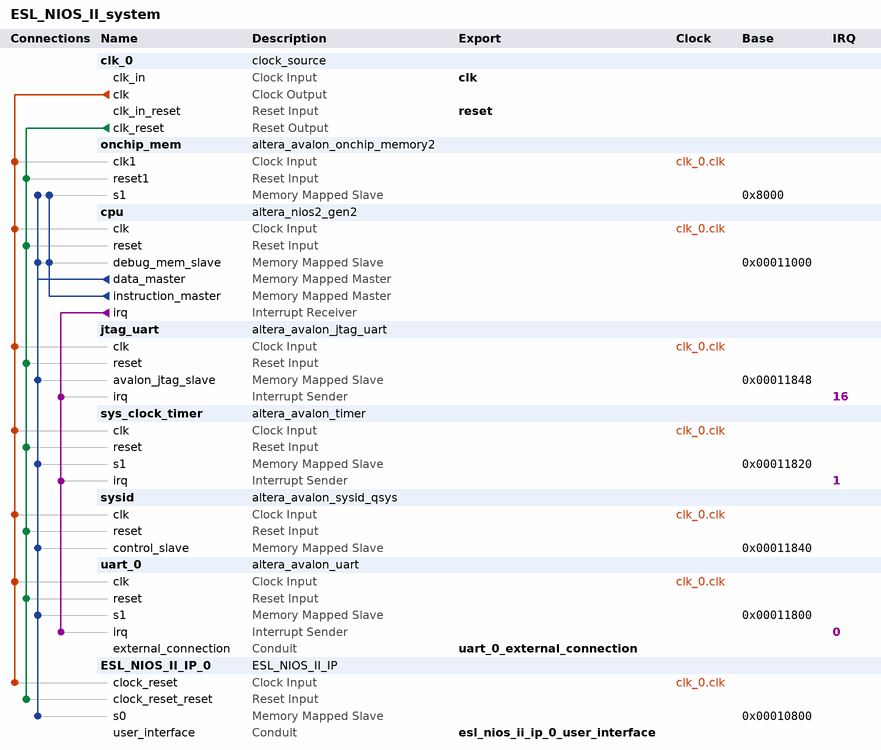
[diagram p0: system contents]
# Platform Designer (Qsys) system ESL_NIOS_II_system, Cyclone IV E EP4CE22F17C6
# Parameters at their usual value, and those the tool derives, are not listed.
package require -exact qsys 18.0
create_system ESL_NIOS_II_system
set_project_property DEVICE_FAMILY {Cyclone IV E}
set_project_property DEVICE EP4CE22F17C6

add_instance clk_0 clock_source 18.0
set_instance_parameter_value clk_0 clockFrequency 50000000

add_instance onchip_mem altera_avalon_onchip_memory2 18.0
set_instance_parameter_value onchip_mem dataWidth 32
set_instance_parameter_value onchip_mem dualPort false
set_instance_parameter_value onchip_mem initMemContent true
set_instance_parameter_value onchip_mem initializationFileName onchip_mem.hex
set_instance_parameter_value onchip_mem memorySize 32768

add_instance cpu altera_nios2_gen2 18.0
set_instance_parameter_value cpu dcache_size 0
set_instance_parameter_value cpu exceptionSlave onchip_mem.s1
set_instance_parameter_value cpu icache_size 2048
set_instance_parameter_value cpu impl Fast
set_instance_parameter_value cpu resetSlave onchip_mem.s1
set_instance_parameter_value cpu setting_activateTrace true

add_instance jtag_uart altera_avalon_jtag_uart 18.0
set_instance_parameter_value jtag_uart simInteractiveOptions NO_INTERACTIVE_WINDOWS

add_instance sys_clock_timer altera_avalon_timer 18.0
set_instance_parameter_value sys_clock_timer period 1
set_instance_parameter_value sys_clock_timer periodUnits MSEC

add_instance sysid altera_avalon_sysid_qsys 18.0
set_instance_parameter_value sysid id 0

add_instance uart_0 altera_avalon_uart 18.0
set_instance_parameter_value uart_0 baud 115200
set_instance_parameter_value uart_0 dataBits 8
set_instance_parameter_value uart_0 fixedBaud true
set_instance_parameter_value uart_0 parity NONE
set_instance_parameter_value uart_0 stopBits 1

add_instance ESL_NIOS_II_IP_0 ESL_NIOS_II_IP 1.0
set_instance_parameter_value ESL_NIOS_II_IP_0 DATA_WIDTH 32
set_instance_parameter_value ESL_NIOS_II_IP_0 LED_WIDTH 8

# connections
add_connection clk_0.clk cpu.clk clock
add_connection clk_0.clk ESL_NIOS_II_IP_0.clock_reset clock
add_connection clk_0.clk jtag_uart.clk clock
add_connection clk_0.clk onchip_mem.clk1 clock
add_connection clk_0.clk sys_clock_timer.clk clock
add_connection clk_0.clk sysid.clk clock
add_connection clk_0.clk uart_0.clk clock
add_connection clk_0.clk_reset cpu.reset reset
add_connection clk_0.clk_reset ESL_NIOS_II_IP_0.clock_reset_reset reset
add_connection clk_0.clk_reset jtag_uart.reset reset
add_connection clk_0.clk_reset onchip_mem.reset1 reset
add_connection clk_0.clk_reset sys_clock_timer.reset reset
add_connection clk_0.clk_reset sysid.reset reset
add_connection clk_0.clk_reset uart_0.reset reset
add_connection cpu.data_master cpu.debug_mem_slave avalon
set_connection_parameter_value cpu.data_master/cpu.debug_mem_slave baseAddress 0x00011000
add_connection cpu.data_master ESL_NIOS_II_IP_0.s0 avalon
set_connection_parameter_value cpu.data_master/ESL_NIOS_II_IP_0.s0 baseAddress 0x00010800
add_connection cpu.data_master jtag_uart.avalon_jtag_slave avalon
set_connection_parameter_value cpu.data_master/jtag_uart.avalon_jtag_slave baseAddress 0x00011848
add_connection cpu.data_master onchip_mem.s1 avalon
set_connection_parameter_value cpu.data_master/onchip_mem.s1 baseAddress 0x8000
add_connection cpu.data_master sys_clock_timer.s1 avalon
set_connection_parameter_value cpu.data_master/sys_clock_timer.s1 baseAddress 0x00011820
add_connection cpu.data_master sysid.control_slave avalon
set_connection_parameter_value cpu.data_master/sysid.control_slave baseAddress 0x00011840
add_connection cpu.data_master uart_0.s1 avalon
set_connection_parameter_value cpu.data_master/uart_0.s1 baseAddress 0x00011800
add_connection cpu.instruction_master cpu.debug_mem_slave avalon
set_connection_parameter_value cpu.instruction_master/cpu.debug_mem_slave baseAddress 0x00011000
add_connection cpu.instruction_master onchip_mem.s1 avalon
set_connection_parameter_value cpu.instruction_master/onchip_mem.s1 baseAddress 0x8000
add_connection cpu.irq jtag_uart.irq interrupt
set_connection_parameter_value cpu.irq/jtag_uart.irq irqNumber 16
add_connection cpu.irq sys_clock_timer.irq interrupt
set_connection_parameter_value cpu.irq/sys_clock_timer.irq irqNumber 1
add_connection cpu.irq uart_0.irq interrupt
set_connection_parameter_value cpu.irq/uart_0.irq irqNumber 0

# exported interfaces
add_interface clk clock sink
set_interface_property clk EXPORT_OF clk_0.clk_in
add_interface esl_nios_ii_ip_0_user_interface conduit end
set_interface_property esl_nios_ii_ip_0_user_interface EXPORT_OF ESL_NIOS_II_IP_0.user_interface
add_interface reset reset sink
set_interface_property reset EXPORT_OF clk_0.clk_in_reset
add_interface uart_0_external_connection conduit end
set_interface_property uart_0_external_connection EXPORT_OF uart_0.external_connection

set_interconnect_requirement {$system} qsys_mm.clockCrossingAdapter HANDSHAKE
set_interconnect_requirement {$system} qsys_mm.insertDefaultSlave false
set_interconnect_requirement {$system} qsys_mm.maxAdditionalLatency 1

save_system ESL_NIOS_II_system.qsys
